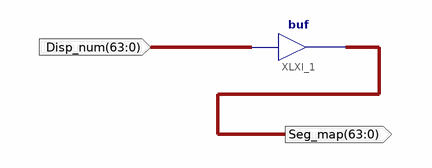
[diagram p0: schematic sheet 1]
// Xilinx ISE schematic SSeg_map.sch (kintex7) as structural Verilog: 1 symbols, 2 ports
module SSeg_map (
  input  [63:0] Disp_num,
  output [63:0] Seg_map
);

  assign Seg_map = Disp_num;  // buf XLXI_1, 64 bits wide
endmodule
